# Altium schematic sheet Interface.SchDoc: Interface
size A4; Engineer: CT; SheetNumber: 1; SheetTotal: 4
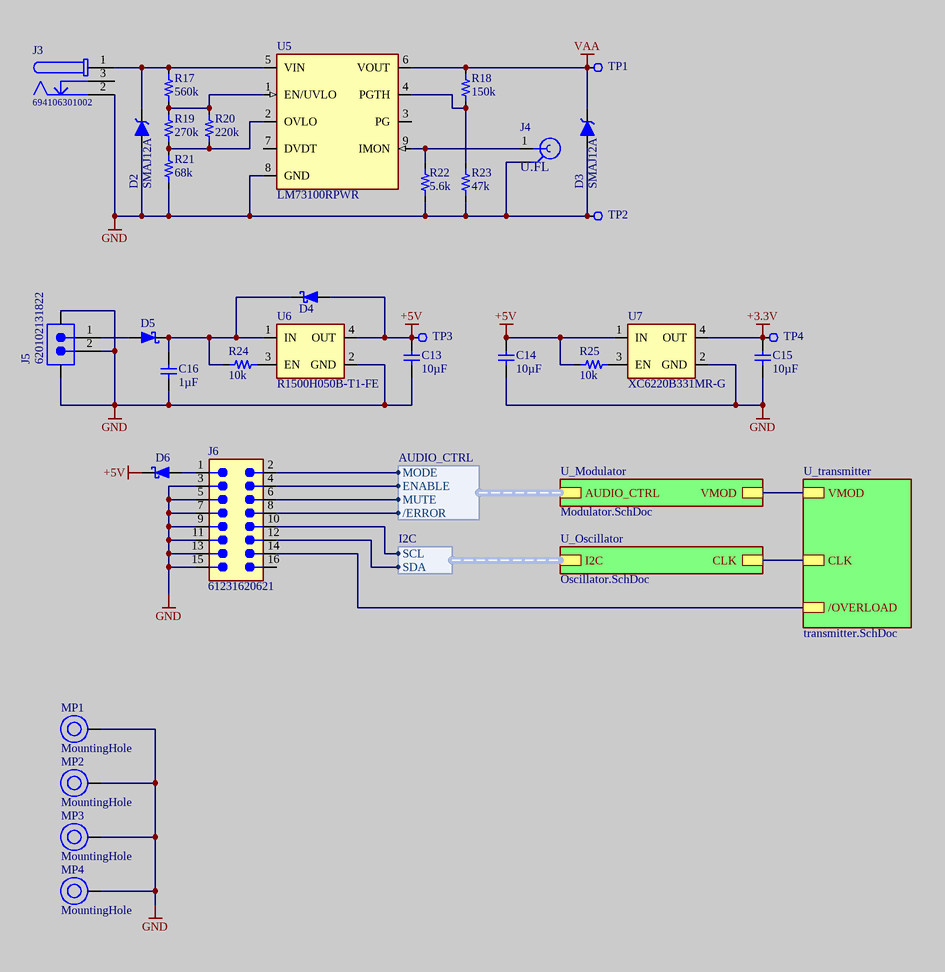
[diagram p0: Interface.SchDoc]

## Parts
C13  value 10µF  [WCAP-CSGP_1210_L3.2W2.5H2]  (hidden comment: Capacitor 10µF +/-10% 16V X7R 1210)
C14  value 10µF  [WCAP-CSGP_1210_L3.2W2.5H2]  (hidden comment: Capacitor 10µF +/-10% 16V X7R 1210)
C15  value 10µF  [WCAP-CSGP_1210_L3.2W2.5H2]  (hidden comment: Capacitor 10µF +/-10% 16V X7R 1210)
C16  value 1µF  [1206-C-N]  (hidden comment: Capacitor 1µF +/-10% 50V X7R 1206)
D2  SMAJ12A  [DO-214AC_UNI]
D3  SMAJ12A  [DO-214AC_UNI]
D4  PMEG10020ELRX  [FP-SOD123W-MFG]  (value not drawn)
D5  PMEG10020ELRX  [FP-SOD123W-MFG]  (value not drawn)
D6  PMEG10020ELRX  [FP-SOD123W-MFG]  (value not drawn)
J3  694106301002  [694106301002]
J4  U.FL-R-SMT(10)  [HRS-U.FL-R-SMT_V]  (value not drawn)
J5  620102131822  [620102131822]
J6  61231620621  [61231620621]
MP1  MountingHole  [PTH-M3D6.5_VIA-RING]  (no BOM)
MP2  MountingHole  [PTH-M3D6.5_VIA-RING]  (no BOM)
MP3  MountingHole  [PTH-M3D6.5_VIA-RING]  (no BOM)
MP4  MountingHole  [PTH-M3D6.5_VIA-RING]  (no BOM)
R17  value 560k  [0603-R-N]  (hidden comment: ERJ-3EKF5603V)
R18  value 150k  [0603-R-N]  (hidden comment: Resistor 150k +/-1% 50V 0603)
R19  value 270k  [0603-R-N]  (hidden comment: RC0603FR-07270KL)
R20  value 220k  [0603-R-N]  (hidden comment: Resistor 220k 1% 0603 0.1W)
R21  value 68k  [0603-R-N]  (hidden comment: Resistor 68k +/-1% 50V 0603)
R22  value 5.6k  [0603-R-N]  (hidden comment: Resistor 5.6k +/-1% 0.1W 0603)
R23  value 47k  [0603-R-N]  (hidden comment: Resistor 47k +/-1% 50V 0603)
R24  value 10k  [0603-R-N]  (hidden comment: Resistor 10k +/-1% 50V 0603)
R25  value 10k  [0603-R-N]  (hidden comment: Resistor 10k +/-1% 50V 0603)
TP1  Testpad with multiple sizes  [TP_1.5mm_0.3mmHole]  (value not drawn)  (no BOM)
TP2  Testpad with multiple sizes  [TP_1.5mm_0.3mmHole]  (value not drawn)  (no BOM)
TP3  Testpad with multiple sizes  [TP_1.5mm_0.3mmHole]  (value not drawn)  (no BOM)
TP4  Testpad with multiple sizes  [TP_1.5mm_0.3mmHole]  (value not drawn)  (no BOM)
U5  LM73100RPWR  [VQFN-HR]
U6  R1500H050B-T1-FE  [SOT-89-MT5_N]
U7  XC6220B331MR-G  [SOT25-N]

## Sub-sheets
U_Modulator = Modulator.SchDoc: AUDIO_CTRL (harness AUDIO_CTRL), VMOD
U_Oscillator = Oscillator.SchDoc: I2C (harness I2C), CLK
U_transmitter = transmitter.SchDoc: /OVERLOAD, CLK, VMOD

## Harnesses
I2C: SDA, SCL
AUDIO_CTRL: MODE, ENABLE, MUTE, /ERROR

## Nets
+3.3V: C15.2 TP4.1(Pad) U7.4(OUT)
+5V: C13.2 C14.2 D4.2(A) D6.1(K) R25.1 TP3.1(Pad) U6.4(OUT) U7.1(IN)
GND: C13.1 C14.1 C15.1 C16.1 D2.2(A) D3.2(A) J3.2 J4.2(GND) J5.2 J5.MP1 J5.MP2 J6.3 J6.5 J6.7 J6.9 J6.11 J6.13 J6.15 MP1.1(H1) MP2.1(H1) MP3.1(H1) MP4.1(H1) R21.1 R22.1 R23.1 TP2.1(Pad) U5.8(GND) U6.2(GND) U7.2(GND)
VAA: D3.1(K) R18.1 TP1.1(Pad) U5.6(VOUT)
NetC16_2: C16.2 D4.1(K) D5.1(K) R24.1 U6.1(IN)
NetD2_1: D2.1(K) J3.1 R17.2 U5.5(VIN)
NetD5_2: D5.2(A) J5.1
NetD6_2: D6.2(A) J6.1
NetJ4_1: J4.1(SIG) R22.2 U5.9(IMON)
NetJ6_2: J6.2 ; sheet U_Modulator/AUDIO_CTRL.MODE
NetJ6_4: J6.4 ; sheet U_Modulator/AUDIO_CTRL.ENABLE
NetJ6_6: J6.6 ; sheet U_Modulator/AUDIO_CTRL.MUTE
NetJ6_8: J6.8 ; sheet U_Modulator/AUDIO_CTRL./ERROR
NetJ6_10: J6.10 ; sheet U_Oscillator/I2C.SCL
NetJ6_12: J6.12 ; sheet U_Oscillator/I2C.SDA
NetJ6_14: J6.14 ; sheet U_transmitter//OVERLOAD
NetR17_1: R17.1 R19.2 R20.2 U5.1(EN/UVLO)
NetR18_2: R18.2 R23.2 U5.4(PGTH)
NetR19_1: R19.1 R20.1 R21.2 U5.2(OVLO)
NetR24_2: R24.2 U6.3(EN)
NetR25_2: R25.2 U7.3(EN)
(unnamed): sheet U_Modulator/VMOD, sheet U_transmitter/VMOD
(unnamed): sheet U_Oscillator/CLK, sheet U_transmitter/CLK

Not connected (* = marked no-connect by the designer): J3 3; J6 16; U5 3(PG) 7(DVDT)

## Notes on the sheet
- Title
- Sheet Revision:
- Link:
- Size:
- Project:
- Engineer:
- A4
- Date:
- Sheet
- of
- File:

## Library data of the parts
C13-C15 = CMP-072-000884-17: WCAP-CSGP Multilayer Ceramic Chip Capacitor, General Purpose, size 1210, X7R, 10µF, 16VDC; FLIR Part #: YCAM10U-8; Dissipation Factor: 5%; Insulation Resistance: 0.1GO; Tolerance: 10%; Capacitor Type: MLCC; Technical Reference: X7R1210106K016DFCT10000; Case/Package: 1210; Source: WCAP-CSGP.SchLib; Width: 2.5mm; Usage: General Purpose; ComponentLink1Description: Website Link; Min Operating Temperature: -55°C; Height: 2mm; Voltage Rating: 16V; ComponentLink1URL: https://www.we-online.com/redexpert/article/885012209014?ad; Length: 3.2mm; ComponentLink2Description: Datasheet Link; Match Code: WCAP-CSGP; JLCPCB Part #: C319189; Dielectric: X7R; Packaging: Tape and Reel; Max Operating Temperature: 125°C; Pins: 2; Mounting Technology: SMT; Design Item ID: 885012209014; ComponentLink2URL: https://www.we-online.com/redexpert/spec/885012209014?ad
C16 = CMP-072-000852-15: WCAP-CSGP Multilayer Ceramic Chip Capacitor, General Purpose, size 1206, X7R, 1µF, 50VDC; Page Part #: CCOK105; Dissipation Factor: 3%; Tolerance: 10%; Technical Reference: X7R1206105K050DFCT10000; Insulation Resistance: 0.5GO; Capacitor Type: MLCC; Mounting Technology: SMT; ComponentLink2Description: Datasheet Link; Width: 1.6mm; Length: 3.2mm; Match Code: WCAP-CSGP; Voltage Rating: 50V; Packaging: Tape and Reel; ComponentLink1Description: Website Link; ComponentLink2URL: https://www.we-online.com/redexpert/spec/885012208093?ad; Pins: 2; Height: 1.6mm; Max Operating Temperature: 125°C; Min Operating Temperature: -55°C; Dielectric: X7R; Design Item ID: 885012208093; Source: WCAP-CSGP.SchLib; Usage: General Purpose; JLCPCB Part #: C1848; Case/Package: 1206; ComponentLink1URL: https://www.we-online.com/redexpert/article/885012208093?ad
D2 D3 = CMP-104-000003-3: SMAJ Series 19.9 V 0.4 kW Surface Mount Uni-Directional TVS Diode - DO-214AC; Manufacturer Part Number: 824500121; Manufacturer: Wurth Elektronik; Polarity: Unidirectional; Power Dissipation: 400W; Operating Voltage (DC): 12V; (Reverse) Breakdown Voltage: 14V; Match Code: WE-TVSP; Clamping Voltage: 19.9V; Value: 12V; (Reverse) Peak Pulse Current: 20.1A; Length: 4.5mm; Packaging: Tape and Reel; Case/Size Code: DO-214AC; Operating Temperature Min: -65°C; Height: 2.087mm; Source: WE-TVSP.SchLib; Component Type: Standard; Category: Surge Protection; Mount: Surface Mount; Pin Count: 2; ComponentLink2URL: https://www.we-online.com/redexpert/spec/824500121?ad; Design Item ID: 824500121; JLCPCB Part #: C726741; ComponentLink2Description: Datasheet Link; ComponentLink1URL: https://www.we-online.com/redexpert/article/824500121?ad; Width: 2.79mm; Operating Temperature Max: 150°C; ComponentLink1Description: Website Link
D4-D6 = CMP-004-00046-7: Diode Schottky 100V 2A 2-Pin SOD-123F T/R; Forward Voltage: 830 mV @ 2 A; Case/Package: SOD-123F; Packaging: Tape and Reel; Max Reverse Voltage (DC): 100V; Mounting Technology: Surface Mount; JLCPCB Part #: C456130; RoHS Compliant: Yes; Average Rectified Current: 2A; Series: -; Forward Current: 2A; Page Part #: ?
J3 = CMP-002-000051-4: WR-DC DC Power Jack Connector, Male, Right Angled, 24V, 5A; Manufacturer: Wurth Elektronik; Opening Diameter: 6.4mm; Plug Inner Diameter: 2.05mm; Plug Outer Diameter: 5.5mm; Working Voltage: 24V; JLCPCB Part #: C5184829; Manufacturer Part Number: 694106301002; ComponentLink2URL: https://www.we-online.com/catalog/datasheet/694106301002.pdf; Design Item ID: 694106301002; Source: WR-DC.SchLib; Gender: Male; ComponentLink2Description: Datasheet; Orientation: Right Angled; Published Date: March 2021; Mounting Technology: THT; ComponentLink1Description: Manufacturer; ComponentLink1URL: http://www.we-online.de; Operating Temperature: -40 to +85degC; Rated Current: 5A; Packaging: Bag
J4 = CMP-002-00035-11: Ultra Small Surface Mount Coaxial Connector, 50 Ohm, -40 to 90 degC, 3-Pin SMD, RoHS, Tape and Reel; pin to pad: 1>3 2>1+2; Manufacturer: Hirose Electric; Resistance: 50Ohm; Connector Type: RF&Coax; Value: U.FL; Package Reference: U.FL-R-SMT; Datasheet Version: Aug-16; Package Description: 3-Pin Surface Mount Device, Body 2.6 x 2.6 mm; Fastening Type: Snap; Datasheet URL: https://www.hirose.com/product/en/download_file/key_name/U.FL/category/Catalog/doc_file_id/31697/?file_category_id=4&item_id=15&is_series=1; Manufacturer URL: https://www.hirose.com; Contact Plating: Gold; Max Operating Temperature: 90°C; Package Quantity: 2500; Impedance: 50Ohm; JLCPCB Part #: C88373; Packaging: TapeandReel; Min Operating Temperature: -40°C; Mounting Technology: SM; RoHS Compliant: True; Contact Material: Brass; Case/Package: U.FL-R-SMT
J5 = CMP-047-000040-14: WR-WTB SMT Male Horizontal Shrouded Header, pitch 2mm, 2p; Page Part #: K620102131822; Contact Resistance: 20mOhm; Rated Current: 2A; Withstanding Voltage: 800VAC; Pin Number: 2; Working Voltage: 100VAC; Published Date: January 2020; ComponentLink1Description: Manufacturer; Packaging: Tape and Reel; Source: WR-WTB_2.00mm.SchLib; Pin Count: 2; Gender: Male; Pitch: 2mm; ComponentLink1URL: http://www.we-online.de; JLCPCB Part #: C295747; Type: Horizontal; Design Item ID: 620102131822; ComponentLink2Description: Datasheet; Component Type: Standard; Operating Temperature: -25 to +85degC; Mounting Technology: SMT; Part Number: 620102131822; ComponentLink2URL: https://www.we-online.com/catalog/datasheet/620102131822.pdf; Publisher: Wurth Elektronik
J6 = CMP-173-000108-2: WR-BHD Male Box Header, SMT Straight, pitch 2.54mm, 2 row, 16 pin; Manufacturer: Wurth Elektronik; Contact Resistance: 20mOhm; Withstanding Voltage: 500V; Working Voltage: 250V; Insulation Resistance: 1000MOhm; Rated Current: 3A; Mount: Surface Mount; Pitch: 2.54mm; JLCPCB Part #: C22387748; Operating Temperature Min: -40°C; Source: WR-BHD.SchLib; Category: Wire-to-Board Connectors; Orientation: Straight; Packaging: Tape and Reel with Cap; ComponentLink2Description: Datasheet Link; Operating Temperature Max: 125°C; Design Item ID: 61231620621; Pin Count: 16; ComponentLink1URL: https://www.we-online.com/redexpert/article/61231620621?ad; Component Type: Standard; Number of Rows: 2; Height: 9.1mm; Length: 28.12mm; Width: 9.1mm; Match Code: WR-BHD; ComponentLink1Description: Website Link; ComponentLink2URL: https://www.we-online.com/redexpert/spec/61231620621?ad; Gender: Male; Number of Pins: 16; Manufacturer Part Number: 61231620621
MP1-MP4 = CMP-00028-00004-14: Mounting hole.  Add this so that mounting holes placed in your design don't automagically disappear when you import changes from the schematic.; Pins: 1
R17 = CMP-009-00383-2: Res Thick Film 0603 560K Ohm 1% 0.1W ±100ppm/°C Molded SMD Punched Carrier T/R; Max Power Dissipation: 100mW; Voltage Rating: 75V; Resistance Tolerance: 1%; Radiation Hardening: No; Package Quantity: 1; Width: 0.8mm; Temperature Coefficient: 100ppm/°C; Military Standard: Not; Pins: 2; Max Operating Temperature: 155°C; Termination: SMD/SMT; Mounting Technology: Surface Mount; Series: ERJ; Packaging: Tape and Reel; JLCPCB Part #: C25822; Number of Terminations: 2; Power Rating: 100mW; Construction: Rectangular; Features: Automotive AEC-Q200; Case/Package: 0603; Resistor Type: Thick Film; RoHS Compliant: Yes; Contact Plating: Tin; Depth: 0.8mm; Case Code (Imperial): 0603; Length: 1.6mm; Case Code (Metric): 1608; Tolerance: 1%; Min Operating Temperature: -55°C; Reach SVHC Compliant: No; Height: 0.022inch; Voltage Rating (DC): 75V
R18 = CMP-009-00237-19: Chip Resistor, Thick Film, General Purpose, 0603, 100mW, 50V, 150 kOhm, +/-1%; FLIR Part #: YRES150K-1; Tolerance: 1%; Elements: 1; Min Operating Temperature: -55°C; Voltage Rating: 50V; Max Operating Temperature: 155°C; Resistor Type: Thick Film; JLCPCB Part #: C22807; Pins: 2; RoHS Compliant: Yes; Usage: General Purpose; Mounting Technology: SMT; Power Rating: 100mW; Case/Package: 0603
R19 = CMP-009-00384-1: SMD Chip Resistor, 270 kOhm, ï¿½ 1%, 100 mW, 0603 [1608 Metric], Thick Film, General Purpose; Max Power Dissipation: 100mW; Voltage Rating (DC): 50V; Temperature Coefficient: 100ppm/°C; Max Operating Temperature: 155°C; Pins: 2; Series: RC; Length: 1.6mm; Reach SVHC Compliant: Unknown; Military Standard: Not; JLCPCB Part #: C22965; Resistance Tolerance: 1%; Features: Moisture Resistant; Case/Package: 0603; Power Rating: 100mW; Case Code (Imperial): 0603; Case Code (Metric): 1608; RoHS Compliant: Yes; Construction: Rectangular; Packaging: Tape and Reel; Resistor Type: Thick Film; Height: 0.45mm; Termination: SMD/SMT; Lead Free: Lead Free; Min Operating Temperature: -55°C; Width: 0.8mm; Depth: 0.8mm; Voltage Rating: 50V; Voltage Rating (AC): 50V; Number of Terminations: 2; Tolerance: 1%
R20 = CMP-009-00344-7: Res Thick Film 0603 220K Ohm 1% 0.1W(1/10W) ±100ppm/C Pad SMD T/R; FLIR Part #: YRES220K-1; Elements: 1; Voltage Rating: 75V; Temperature Coefficient: 100ppm/°C; Power Rating: 100mW; Usage: General Purpose; Pins: 2; Resistor Type: Thick Film; Mounting Technology: SMT; Lead Free: Lead Free; Case/Package: 0603; Tolerance: 1%; RoHS Compliant: Yes; Max Operating Temperature: 155°C; Min Operating Temperature: -55°C; JLCPCB Part #: C22961
R21 = CMP-009-00207-23: Chip Resistor, Thick Film, General Purpose, 0603, 100mW, 50V, 68 kOhm, +/-1%; Page Part #: ROQF6802; Tolerance: 1%; Elements: 1; Usage: General Purpose; Pins: 2; RoHS Compliant: Yes; Power Rating: 100mW; Max Operating Temperature: 155°C; Mounting Technology: SMT; Voltage Rating: 50V; Case/Package: 0603; JLCPCB Part #: C114633; Min Operating Temperature: -55°C; Resistor Type: Thick Film
R22 = CMP-009-00287-10: Res Thick Film 0603 5.6K Ohm 1% 0.1W(1/10W) ±100ppm/C Pad SMD T/R; Usage: General Purpose; Elements: 1; Temperature Coefficient: 100ppm/°C; Power Rating: 100mW; Voltage Rating: 75V; Case/Package: 0603; JLCPCB Part #: C23189; Mounting Technology: SMT; Min Operating Temperature: -55°C; Max Operating Temperature: 155°C; Pins: 2; Resistor Type: Thick Film; RoHS Compliant: Yes; Lead Free: Lead Free; Features: Moisture Resistant; Tolerance: 1%
R23 = CMP-009-00195-22: Chip Resistor, Thick Film, General Purpose, 0603, 100mW, 50V, 47 kOhm, +/-1%; FLIR Part #: YRES47K-1; Page Part #: ROQF4702; Tolerance: 1%; Elements: 1; Temperature Coefficient: 100ppm/°C; Voltage Rating: 50V; Case/Package: 0603; Usage: General Purpose; Min Operating Temperature: -55°C; JLCPCB Part #: C25819; REACH SVHC: No SVHC; Pins: 2; Mounting Technology: SMT; Max Operating Temperature: 155°C; Power Rating: 100mW; Resistor Type: Thick Film
R24 R25 = CMP-009-00017-28: Chip Resistor, Thick Film, General Purpose, 0603, 100mW, 50V, 10 kOhm, +/-1%; FLIR Part #: YRES10K-1; Page Part #: ROQF1002; Tolerance: 1%; Elements: 1; RoHS Compliant: Yes; Mounting Technology: SMT; Pins: 2; Case/Package: 0603; Usage: General Purpose; JLCPCB Part #: C25804; Max Operating Temperature: 155°C; Min Operating Temperature: -55°C; Power Rating: 100mW; Resistor Type: Thick Film; Voltage Rating: 50V
TP1-TP4 = CMP-027-000000-16: Testpad land; Component Type: Standard; Design Item ID: Testpad; Pin Count: 1
U5 = CMP-019-00108-1: 2.7V~23V 5.5A VQFN-10-HR(2x2) Power Distribution Switches ROHS; JLCPCB Part #: C3210761; RoHS Compliant: Yes
U6 = CMP-019-00086-12: Fixed LDO 5V, 2%, 500mA, Iq 130uA, -40°C to 105*C; pin to pad: 2>2+3 3>4 4>5; Dropout Voltage: 225mV; Min Input Voltage: 4V; Number of Regulators: 1; Max Input Voltage: 24V; Min Operating Temperature: -40°C; Output Type: Fixed; Mount: SMT; Output Voltage: 5V; Case/Package: SOT-89-5; Output Current: 500mA; Number of Outputs: 1; Accuracy: 2%; Max Operating Temperature: 105*C; JLCPCB Part #: C3751570; Quiescent Current: 130uA
U7 = CMP-019-00081-10: Fixed LDO 3.3V, 1%, 1A, Iq 108uA, -40°C to 85°C; pin to pad: 4>5; Number of Regulators: 1; Max Input Voltage: 6V; Min Input Voltage: 4V; Output Voltage: 3.3V; JLCPCB Part #: C86534; Max Operating Temperature: 85°C; Case/Package: SOT-23-5; Mount: SMT; Accuracy: 1%; Number of Outputs: 1; Quiescent Current: 108uA; Output Current: 1A; Min Operating Temperature: -40°C; Output Type: Fixed